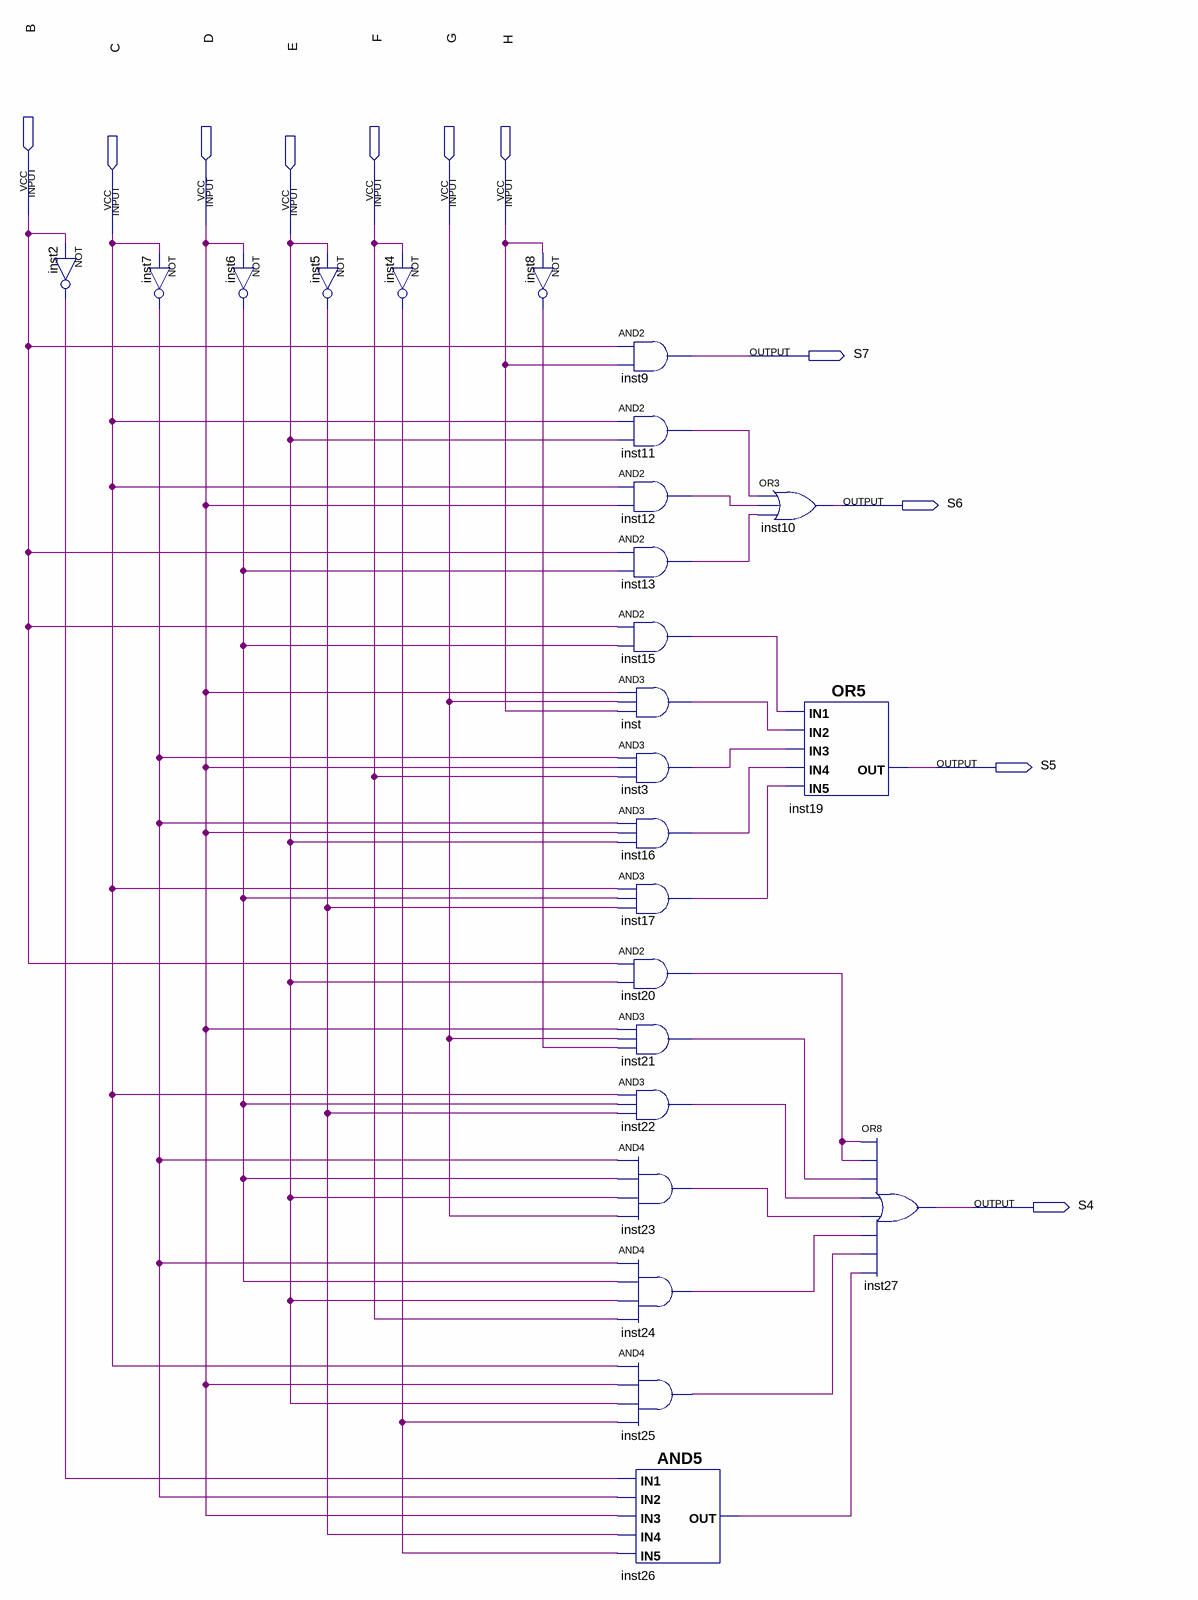
[diagram p0: schematic sheet]
// Quartus schematic BCDCIMA.bdf as structural Verilog: 25 symbols, 11 pins
module BCDCIMA (
  input  B,
  input  D,
  input  F,
  input  G,
  input  H,
  input  C,
  input  E,
  output S7,
  output S6,
  output S5,
  output S4
);

  wire inst2_out, inst3_out, inst4_out, inst5_out, inst6_out, inst7_out, inst8_out, inst11_out, inst12_out,
       inst13_out, inst15_out, inst16_out, inst17_out, inst20_out, inst21_out, inst22_out, inst23_out,
       inst24_out, inst25_out, inst26_out, inst_out;

  not inst2 (inst2_out, B);
  not inst7 (inst7_out, C);
  not inst6 (inst6_out, D);
  not inst5 (inst5_out, E);
  not inst4 (inst4_out, F);
  not inst8 (inst8_out, H);
  and inst9 (S7, B, H);
  and inst11 (inst11_out, C, E);
  and inst12 (inst12_out, C, D);
  and inst13 (inst13_out, B, inst6_out);
  and inst15 (inst15_out, B, inst6_out);
  and inst (inst_out, D, G, H);
  and inst3 (inst3_out, inst7_out, D, F);
  and inst16 (inst16_out, inst7_out, D, E);
  and inst17 (inst17_out, C, inst6_out, inst5_out);
  and inst20 (inst20_out, B, E);
  and inst21 (inst21_out, D, G, inst8_out);
  and inst22 (inst22_out, C, inst6_out, inst5_out);
  and inst23 (inst23_out, inst7_out, inst6_out, E, G);
  and inst24 (inst24_out, inst7_out, inst6_out, E, F);
  and inst25 (inst25_out, C, D, E, inst4_out);
  and inst26 (inst26_out, inst2_out, inst7_out, D, inst5_out, inst4_out);
  or inst10 (S6, inst11_out, inst12_out, inst13_out);
  or inst19 (S5, inst15_out, inst_out, inst3_out, inst16_out, inst17_out);
  or inst27 (S4, inst20_out, inst20_out, inst21_out, inst22_out, inst23_out, inst24_out, inst25_out, inst26_out);
endmodule
